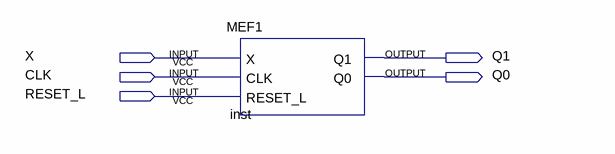
[diagram p0: schematic sheet]
// Quartus schematic MEF.bdf as structural Verilog: 1 symbols, 5 pins
module MEF (
  input  X,
  input  CLK,
  input  RESET_L,
  output Q1,
  output Q0
);

  MEF1 inst (.X(X), .CLK(CLK), .RESET_L(RESET_L), .Q1(Q1), .Q0(Q0));
endmodule
